# EAGLE schematic ssChildSignalTower (EAGLE 8.5.1)
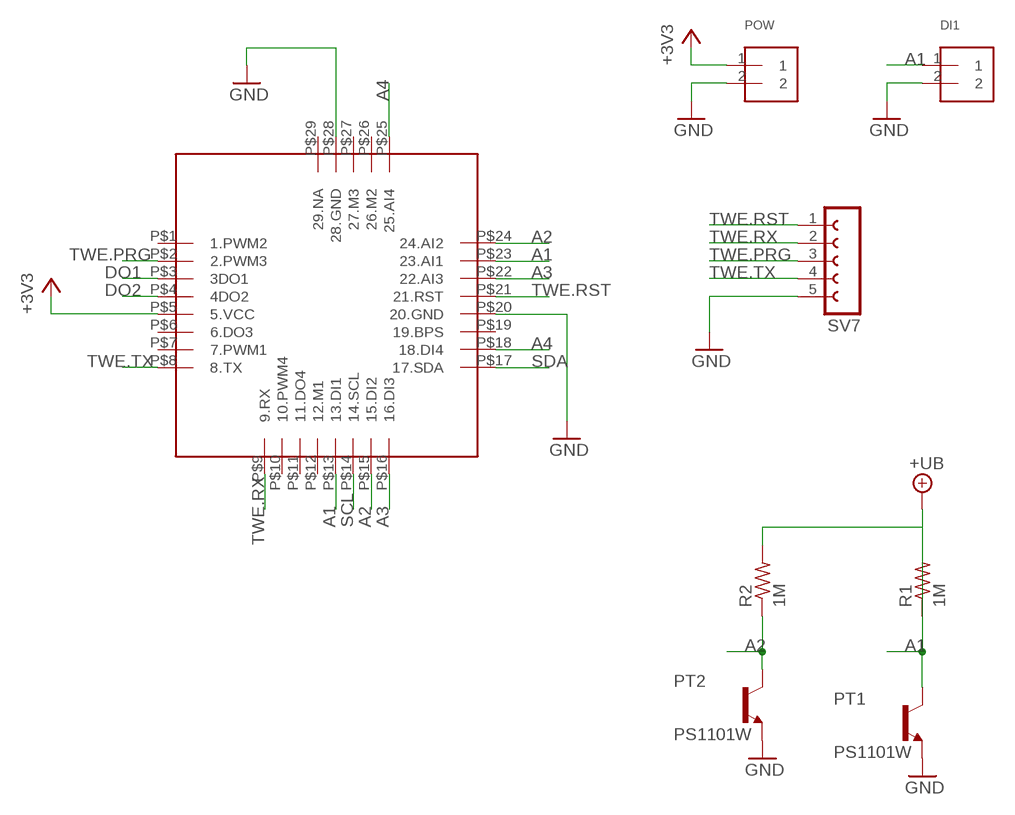
[diagram p0: schematic, sheet 1]

## Parts
DI1  AMON0.5SQ_WIRE_HOLE  [AMON0.5SQ_WIRE_HOLE]
POW  AMON0.5SQ_WIRE_HOLE  [AMON0.5SQ_WIRE_HOLE]
PT1  PS1101W  GL-01674-PS1101W-PHOTOTRANSISTOR  [GL-01674-PS1101W-PHOTO-TRANSISTOR]
PT2  PS1101W  GL-01674-PS1101W-PHOTOTRANSISTOR  [GL-01674-PS1101W-PHOTO-TRANSISTOR]
R1  1M  R-US_R0603  [R0603]
R2  1M  R-US_R0603  [R0603]
SV7  FE05-1  [FE05-1]
U$1  LITE  [LITE]

## Nets
+3V3: POW.1 U$1.P$5(5.VCC)
+UB: R1.1 R2.2
A1: DI1.1 PT1.C R1.2 U$1.P$13(13.DI1) U$1.P$23(23.AI1)
A2: PT2.C R2.1 U$1.P$15(15.DI2) U$1.P$24(24.AI2)
A3: U$1.P$16(16.DI3) U$1.P$22(22.AI3)
A4: U$1.P$18(18.DI4) U$1.P$25(25.AI4)
DO1: U$1.P$3(3DO1)
DO2: U$1.P$4(4DO2)
GND: DI1.2 POW.2 PT1.E PT2.E SV7.5 U$1.P$20(20.GND) U$1.P$28(28.GND)
SCL: U$1.P$14(14.SCL)
SDA: U$1.P$17(17.SDA)
TWE.PRG: SV7.3 U$1.P$2(2.PWM3)
TWE.RST: SV7.1 U$1.P$21(21.RST)
TWE.RX: SV7.2 U$1.P$9(9.RX)
TWE.TX: SV7.4 U$1.P$8(8.TX)
Unconnected: U$1.P$1(1.PWM2) U$1.P$6(6.DO3) U$1.P$7(7.PWM1) U$1.P$10(10.PWM4) U$1.P$11(11.DO4) U$1.P$12(12.M1) U$1.P$19(19.BPS) U$1.P$26(26.M2) U$1.P$27(27.M3) U$1.P$29(29.NA)

## Library data of the parts
DI1 POW = Akizuki:AMON0.5SQ_WIRE_HOLE
PT1 PT2 = Akizuki:GL-01674-PS1101W-PHOTOTRANSISTOR
R1 R2 = rcl:R-US_: RESISTOR, American symbol
SV7 = con-lsta:FE05-1: FEMALE HEADER; OC_FARNELL: unknown; OC_NEWARK: unknown
U$1 = TWELite:LITE